# EAGLE schematic power_ver2 (EAGLE 9.6.2)
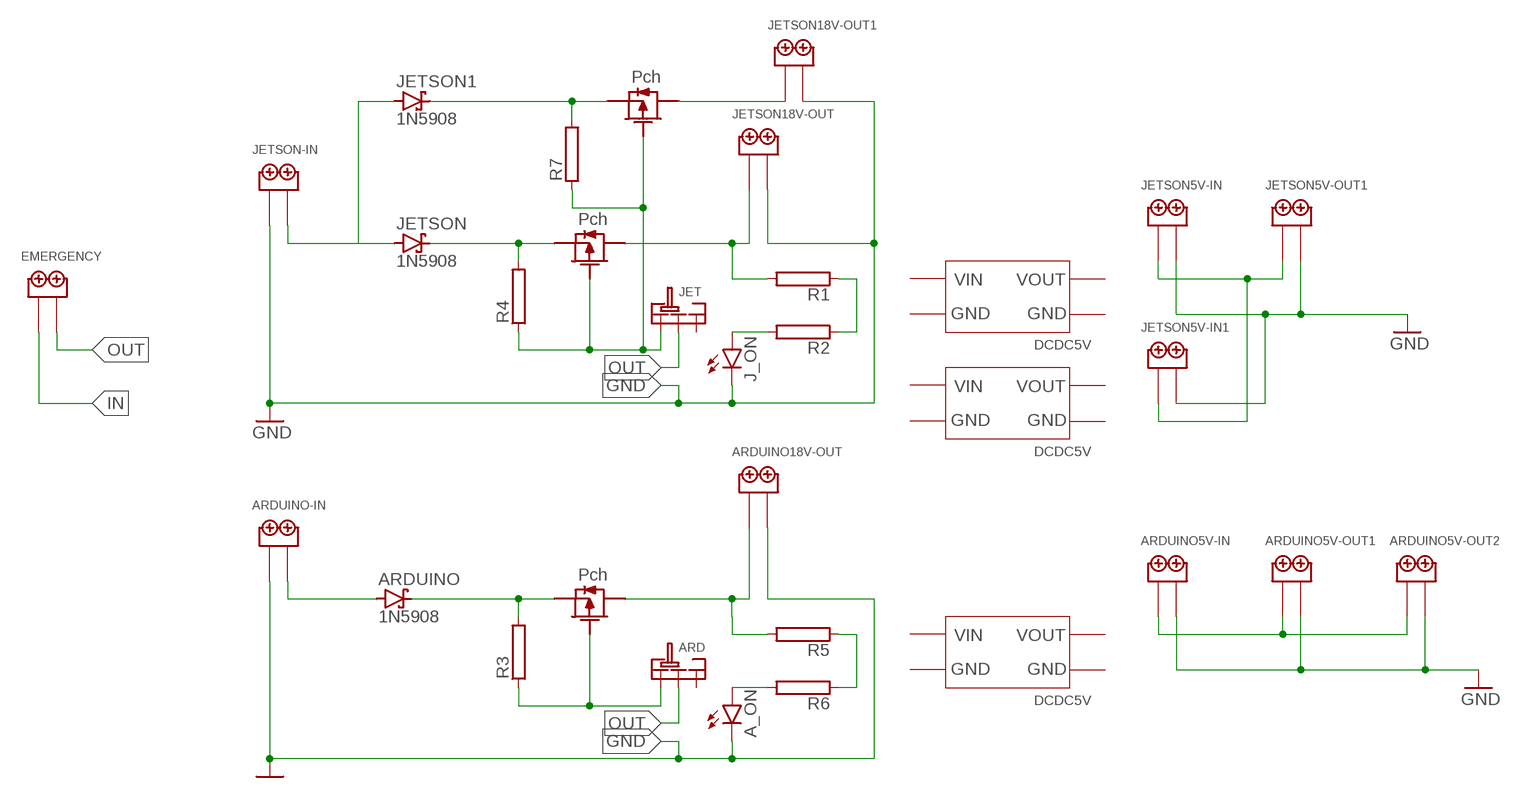
[diagram p0: schematic, sheet 1]

## Parts
A_ON  LED5MM  [LED5MM]
ARD  SRIDE_SWITCH  [SRIDE_SWITCH]
ARDUINO  1N5908  [C4111-15]
ARDUINO5V-IN  2PIN  [2PIN]
ARDUINO5V-OUT1  2PIN  [2PIN]
ARDUINO5V-OUT2  2PIN  [2PIN]
ARDUINO18V-OUT  2PIN  [2PIN]
ARDUINO-IN  2PIN  [2PIN]
EMERGENCY  2PIN  [2PIN]
J_ON  LED5MM  [LED5MM]
JET  SRIDE_SWITCH  [SRIDE_SWITCH]
JETSON  1N5908  [C4111-15]
JETSON1  1N5908  [C4111-15]
JETSON5V-IN  2PIN  [2PIN]
JETSON5V-IN1  2PIN  [2PIN]
JETSON5V-OUT1  2PIN  [2PIN]
JETSON18V-OUT  2PIN  [2PIN]
JETSON18V-OUT1  2PIN  [2PIN]
JETSON-IN  2PIN  [2PIN]
R1  RAC01  [AC01]
R2  RAC01  [AC01]
R3  RAC01  [AC01]
R4  RAC01  [AC01]
R5  RAC01  [AC01]
R6  RAC01  [AC01]
R7  RAC01  [AC01]
U$1  2SJ334  [2SJ334]
U$2  DCDCDEV  [DCDCDEV]
U$4  2SJ334  [2SJ334]
U$5  2SJ334  [2SJ334]
U$6  DCDCDEV  [DCDCDEV]
U$23  DCDCDEV  [DCDCDEV]

## Nets
18V [power]: JETSON1.A JETSON-IN.P$2 JETSON.A
GND: A_ON.K(C) ARDUINO5V-IN.P$2 ARDUINO5V-OUT1.P$2 ARDUINO5V-OUT2.P$2 ARDUINO18V-OUT.P$2 ARDUINO-IN.P$1 J_ON.K(C) JETSON5V-IN1.P$2 JETSON5V-IN.P$2 JETSON5V-OUT1.P$2 JETSON18V-OUT1.P$2 JETSON18V-OUT.P$2 JETSON-IN.P$1
IN: EMERGENCY.P$1
MA [power]: JETSON.C R4.2 U$4.SOURCE
MA1 [power]: JETSON1.C R7.2 U$1.SOURCE
MAC [power]: JETSON18V-OUT.P$1 R1.2 U$4.DRAIN
MAD [jet]: JETSON5V-IN1.P$1 JETSON5V-IN.P$1 JETSON5V-OUT1.P$1
MBB [power]: ARDUINO-IN.P$2 ARDUINO.A
MKK [power]: ARDUINO.C R3.2 U$5.SOURCE
ML [power]: ARDUINO5V-IN.P$1 ARDUINO5V-OUT1.P$1 ARDUINO5V-OUT2.P$1
MOO [power]: ARDUINO18V-OUT.P$1 R5.2 U$5.DRAIN
N$1: ARD.L R3.1 U$5.GATE
N$2: J_ON.A R2.2
N$3: A_ON.A R6.2
N$4 [power]: JET.L R4.1 R7.1 U$1.GATE U$4.GATE
N$5: JETSON18V-OUT1.P$1 U$1.DRAIN
N$6: R5.1 R6.1
N$49: R1.1 R2.1
OUT: ARD.LR EMERGENCY.P$2 JET.LR
Unconnected: ARD.R JET.R

## Library data of the parts
A_ON J_ON = led:LED: LED OSRAM: - CHIPLED LG R971, LG N971, LY N971, LG Q971, LY Q971, LO R971, LY R971 LH N974, LH R974 LS Q976, LO Q976, LY Q976 LO Q996 - Hyper CHIPLED LW Q18S LB Q993, LB Q99A, LB R99A - SideLED LS A670, LO A670, LY A670, LG A670, LP A670 LB A673, LV A673, LT A673, LW A673 LH A674 LY A675 LS A676, LA A676, LO A676, LY A676, LW A676 LS A679, LY A679, LG A679 - Hyper Micro SIDELED® LS Y876, LA Y876, LO Y876, LY Y876 LT Y87S - SmartLED LW L88C, LW L88S LB L89C, LB L89S, LG L890 LS L89K, LO L89K, LY L89K LS L896, LA L896, LO L896, LY L896 - TOPLED LS T670, LO T670, LY T670, LG T670, LP T670 LSG T670, LSP T670, LSY T670, LOP T670, LYG T670 LG T671, LOG T671, LSG T671 LB T673, LV T673, LT T673, LW T673 LH T674 LS T676, LA T676, LO T676, LY T676, LB T676, LH T676, LSB T676, LW T676 LB T67C, LV T67C, LT T67C, LS T67K, LO T67K, LY T67K, LW E67C LS E67B, LA E67B, LO E67B, LY E67B, LB E67C, LV E67C, LT E67C LW T67C LS T679, LY T679, LG T679 LS T770, LO T770, LY T770, LG T770, LP T770 LB T773, LV T773, LT T773, LW T773 LH T774 LS E675, LA E675, LY E675, LS T675 LS T776, LA T776, LO T776, LY T776, LB T776 LHGB T686 LT T68C, LB T68C - Hyper Mini TOPLED® LB M676 - Mini TOPLED Santana® LG M470 LS M47K, LO M47K, LY M47K Source: http://www.osram.convergy.de LUXEON: - LUMILED® LXK2-PW12-R00, LXK2-PW12-S00, LXK2-PW14-U00, LXK2-PW14-V00 LXK2-PM12-R00, LXK2-PM12-S00, LXK2-PM14-U00 LXK2-PE12-Q00, LXK2-PE12-R00, LXK2-PE12-S00, LXK2-PE14-T00, LXK2-PE14-U00 LXK2-PB12-K00, LXK2-PB12-L00, LXK2-PB12-M00, LXK2-PB14-N00, LXK2-PB14-P00, LXK2-PB14-Q00 LXK2-PR12-L00, LXK2-PR12-M00, LXK2-PR14-Q00, LXK2-PR14-R00 LXK2-PD12-Q00, LXK2-PD12-R00, LXK2-PD12-S00 LXK2-PH12-R00, LXK2-PH12-S00 LXK2-PL12-P00, LXK2-PL12-Q00, LXK2-PL12-R00 Source: www.luxeon.com KINGBRIGHT: KA-3528ASYC Source: www.kingbright.com
ARD JET = Sride Switch:SRIDE_SWITCH
ARDUINO JETSON JETSON1 = diode:1N5908: DIODE schottky
ARDUINO5V-IN ARDUINO5V-OUT1 ARDUINO5V-OUT2 ARDUINO18V-OUT ARDUINO-IN EMERGENCY JETSON5V-IN JETSON5V-IN1 JETSON5V-OUT1 JETSON18V-OUT JETSON18V-OUT1 JETSON-IN = TB113-2B-x-x-0-x-x:2PIN
R1-R7 = resistor-power:R: Power Resitor; OC_FARNELL: unknown; OC_NEWARK: unknown
U$1 U$4 U$5 = 2SJ334:2SJ334
U$2 U$6 U$23 = dcdcDEVkit:DCDCDEV

## Net classes
0 default: width 1.016 mm
1 power: width 2.54 mm, clearance 0.127 mm
3 jet: width 3.81 mm, clearance 0.127 mm